# EAGLE schematic tlc5940-big-driver-mk-1.0.0 (EAGLE 9.2.2)
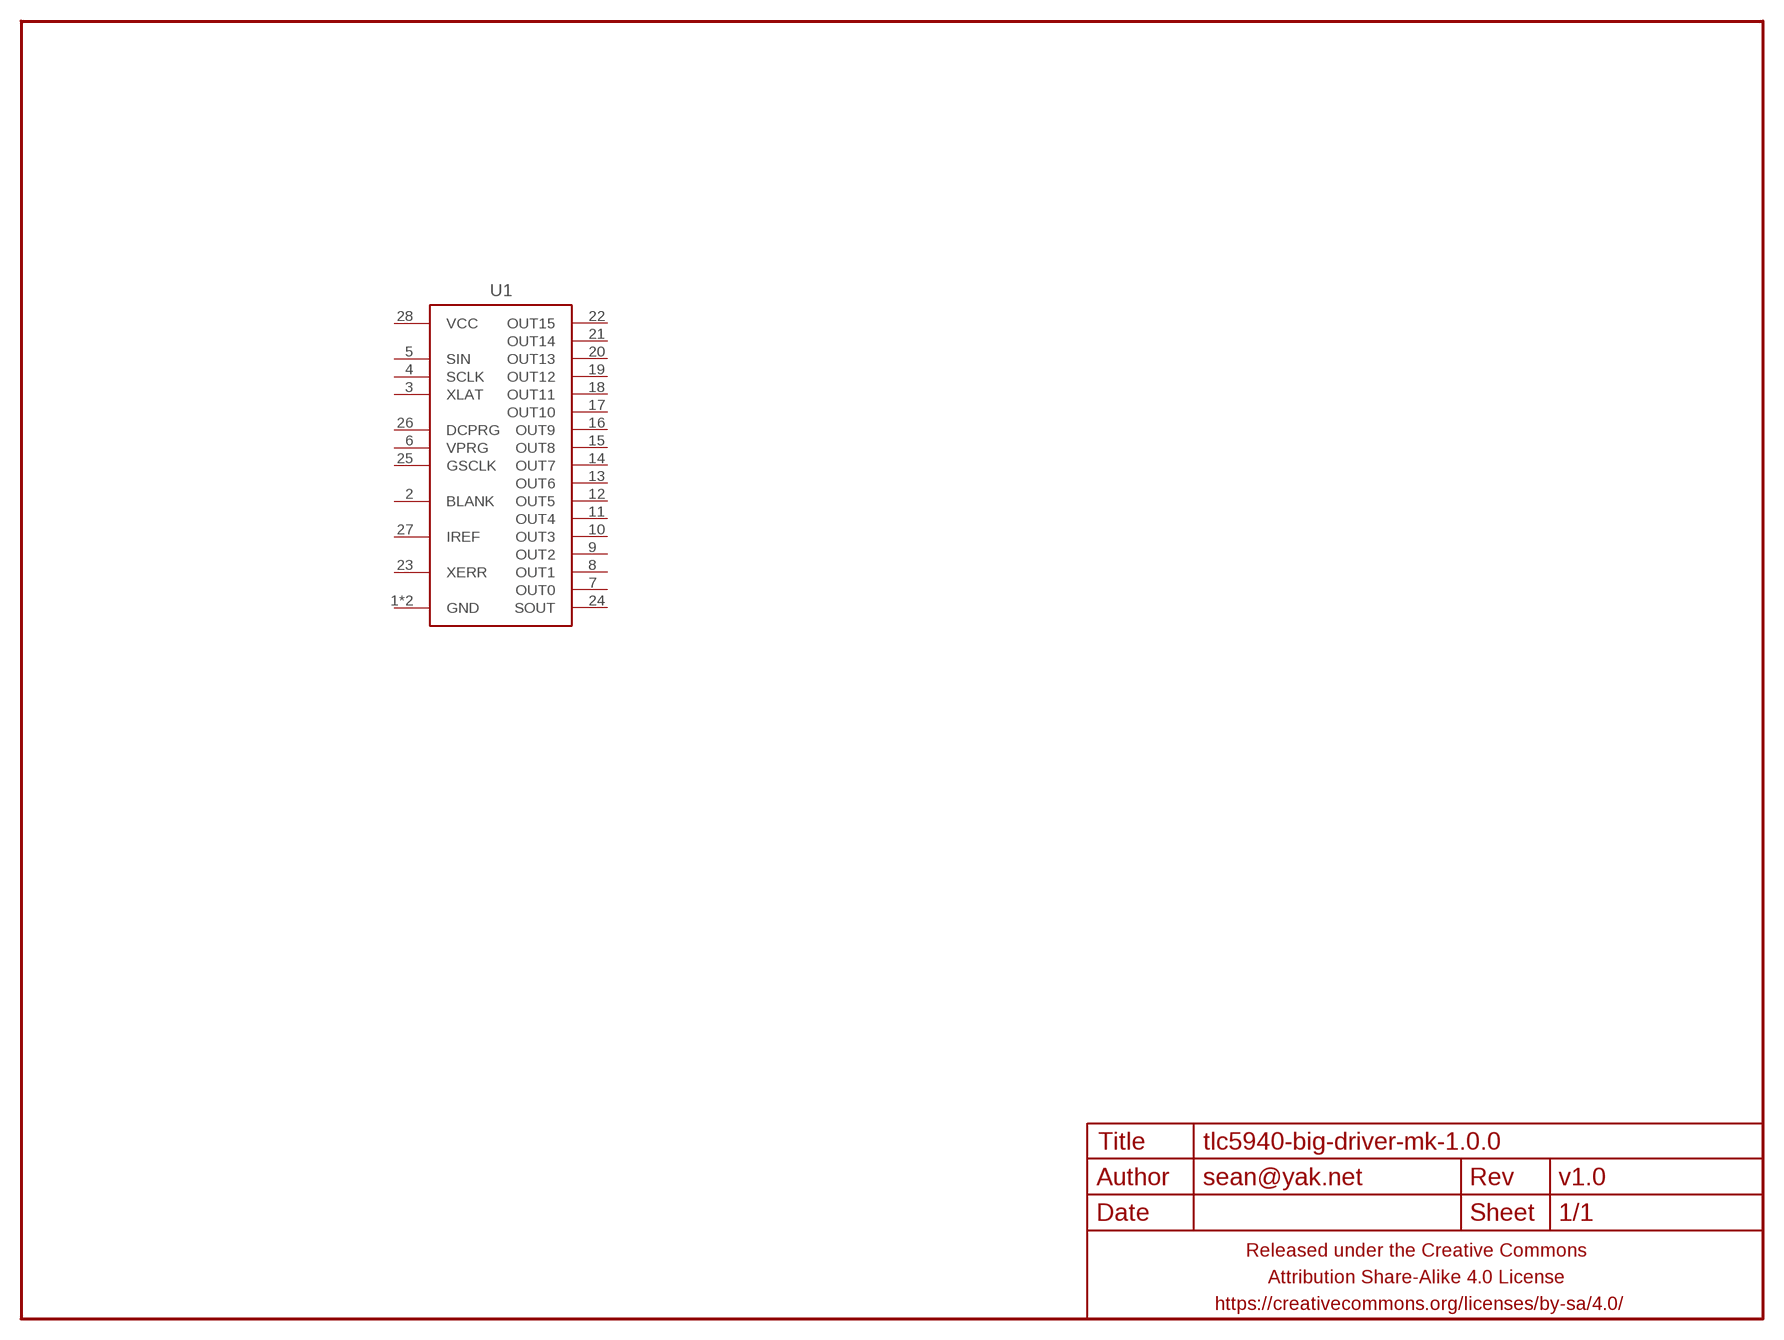
[diagram p0: schematic, sheet 1]

## Parts
FRAME1  FRAME-LETTERNO_PACKAGE  [DUMMY]
U1  TLC5940PWP  [SOP65P640X120-28]
Unconnected: U1.1(GND) U1.2(BLANK) U1.3(XLAT) U1.4(SCLK) U1.5(SIN) U1.6(VPRG) U1.7(OUT0) U1.8(OUT1) U1.9(OUT2) U1.10(OUT3) U1.11(OUT4) U1.12(OUT5) U1.13(OUT6) U1.14(OUT7) U1.15(OUT8) U1.16(OUT9) U1.17(OUT10) U1.18(OUT11) U1.19(OUT12) U1.20(OUT13) U1.21(OUT14) U1.22(OUT15) U1.23(XERR) U1.24(SOUT) U1.25(GSCLK) U1.26(DCPRG) U1.27(IREF) U1.28(VCC) U1.PAD(GND)

## Library data of the parts
FRAME1 = a_parts:FRAME-LETTER: Schematic Frame Standard 8.5x11 US Letter frame; DESIGNER: sean@yak.net; VERSION: v1.0
U1 = a_parts:TLC5940